# EAGLE design Proc (EAGLE 4.16)
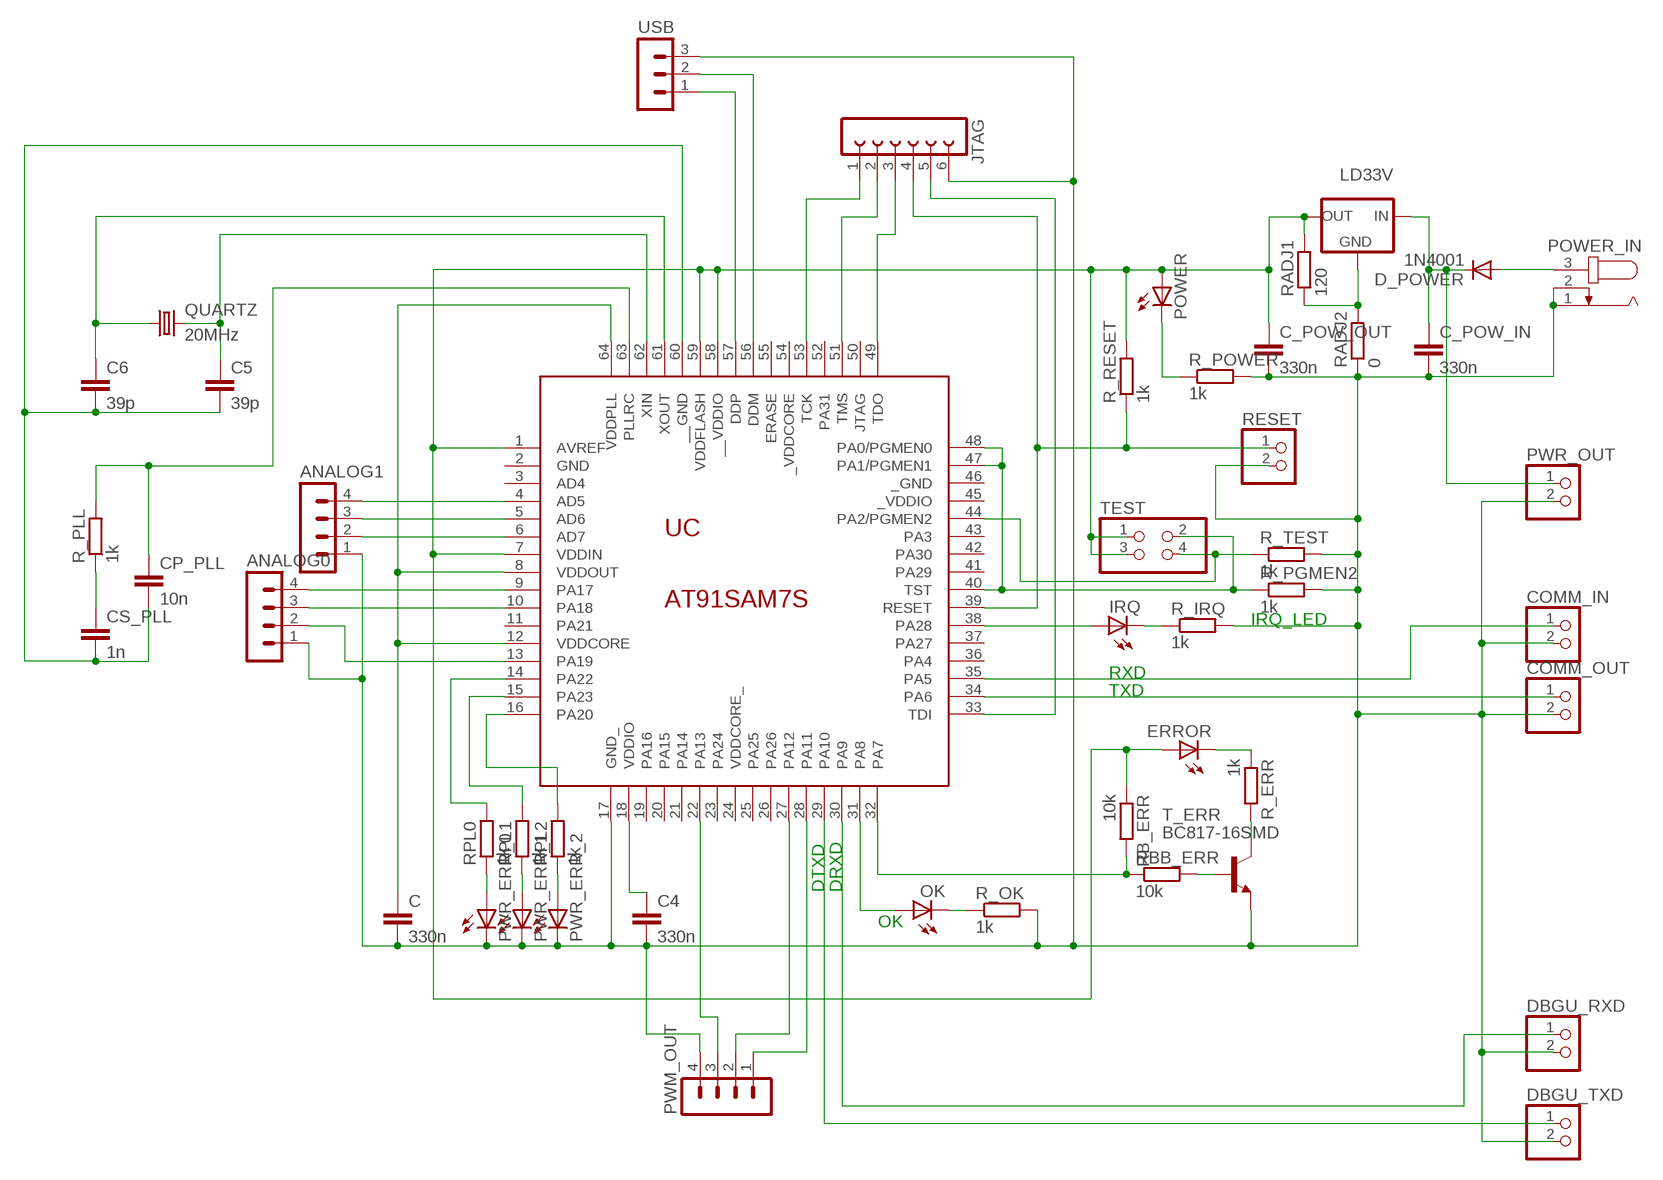
[diagram p0: schematic, sheet 1]

## Parts
ANALOG0  MA04-1  [MA04-1]
ANALOG1  MA04-1  [MA04-1]
C  330n  C-EUC1210  [C1210]
C4  330n  C-EUC1210  [C1210]
C5  39p  C-EUC1210  [C1210]
C6  39p  C-EUC1210  [C1210]
C_POW_IN  330n  C-EUC1210  [C1210]
C_POW_OUT  330n  C-EUC1210  [C1210]
COMM_IN  PINHD-1X2  [1X02]
COMM_OUT  PINHD-1X2  [1X02]
CP_PLL  10n  C-EUC1210  [C1210]
CS_PLL  1n  C-EUC1210  [C1210]
D_POWER  1N4001  DIODE-SMB  [SMB]
DBGU_RXD  PINHD-1X2  [1X02]
DBGU_TXD  PINHD-1X2  [1X02]
ERROR  LEDCHIPLED_1206  [CHIPLED_1206]
IRQ  LEDCHIPLED_1206  [CHIPLED_1206]
JTAG  FE06-1  [FE06]
LD33V  LD33  [LD33]
OK  LEDCHIPLED_1206  [CHIPLED_1206]
POWER  LEDCHIPLED_1206  [CHIPLED_1206]
POWER_IN  JACK-PLUG0  [SPC4077]
PWM_OUT  MA04-1  [MA04-1]
PWR_ERR_0  LEDCHIPLED_1206  [CHIPLED_1206]
PWR_ERR_1  LEDCHIPLED_1206  [CHIPLED_1206]
PWR_ERR_2  LEDCHIPLED_1206  [CHIPLED_1206]
PWR_OUT  PINHD-1X2  [1X02]
QUARTZ  20MHz  CRYSTALSM49  [SM49]
R_ERR  1k  R-EU_M1206  [M1206]
R_IRQ  1k  R-EU_M1206  [M1206]
R_OK  1k  R-EU_M1206  [M1206]
R_PGMEN2  1k  R-EU_M1206  [M1206]
R_PLL  1k  R-EU_M1206  [M1206]
R_POWER  1k  R-EU_M1206  [M1206]
R_RESET  1k  R-EU_M1206  [M1206]
R_TEST  1k  R-EU_M1206  [M1206]
RADJ1  120  R-EU_M1206  [M1206]
RADJ2  0  R-EU_M1206  [M1206]
RB_ERR  10k  R-EU_M1206  [M1206]
RBB_ERR  10k  R-EU_M1206  [M1206]
RESET  PINHD-1X2  [1X02]
RPL0  1k  R-EU_M1206  [M1206]
RPL1  1k  R-EU_M1206  [M1206]
RPL2  1k  R-EU_M1206  [M1206]
T_ERR  BC817-16SMD  [SOT23-BEC]
TEST  PINHD-2X2  [2X02]
UC  AT91SAM7S  [VQFP64]
USB  MA03-1  [MA03-1]

## Nets
N$1: ERROR.C R_ERR.1
N$2: C.1 UC.8(VDDOUT) UC.12(VDDCORE) UC.64(VDDPLL)
N$3: DBGU_RXD.1 UC.30(PA9)
N$4: C4.1 UC.18(VDDIO)
N$5: C5.2 C6.2 CP_PLL.2 CS_PLL.2 UC.60(__GND)
N$6: D_POWER.A POWER_IN.3
N$7: DBGU_TXD.1 UC.29(PA10)
N$8: POWER.C R_POWER.1
N$9: R_PGMEN2.1 TEST.2 UC.40(TST) UC.47(PA1/PGMEN1) UC.48(PA0/PGMEN0)
N$10: C6.1 QUARTZ.1 UC.61(XOUT)
N$11: C5.1 QUARTZ.2 UC.62(XIN)
N$12: R_TEST.1 TEST.4 UC.44(PA2/PGMEN2)
N$13: ANALOG1.4 UC.4(AD5)
N$14: CP_PLL.1 R_PLL.2 UC.63(PLLRC)
N$15: CS_PLL.1 R_PLL.1
N$16: RBB_ERR.2 T_ERR.B
N$17: JTAG.1 UC.53(TCK)
N$18: JTAG.2 UC.51(TMS)
N$19: JTAG.3 UC.49(TDO)
N$20: JTAG.5 UC.33(TDI)
N$21: JTAG.4 R_RESET.1 RESET.1 UC.39(RESET)
N$23: COMM_IN.1 UC.35(PA5)
N$24: LD33V.GND RADJ1.1 RADJ2.2
N$26: COMM_OUT.1 UC.34(PA6)
N$27: UC.57(DDP) USB.1
N$28: UC.56(DDM) USB.2
N$29: ANALOG0.1 ANALOG1.1 C4.2 C.2 C_POW_IN.2 C_POW_OUT.2 COMM_IN.2 COMM_OUT.2 DBGU_RXD.2 DBGU_TXD.2 JTAG.6 POWER_IN.1 POWER_IN.2 PWM_OUT.4 PWR_ERR_0.C PWR_ERR_1.C PWR_ERR_2.C PWR_OUT.2 R_IRQ.2 R_OK.2 R_PGMEN2.2 R_POWER.2 R_TEST.2 RADJ2.1 RESET.2 T_ERR.E UC.17(GND_) USB.3
N$30: PWM_OUT.1 UC.28(PA11)
N$31: PWM_OUT.2 UC.27(PA12)
N$32: PWM_OUT.3 UC.22(PA13)
N$33: ANALOG1.3 UC.5(AD6)
N$34: ANALOG1.2 UC.6(AD7)
N$35: ANALOG0.4 UC.9(PA17)
N$36: ANALOG0.3 UC.10(PA18)
N$37: ANALOG0.2 UC.13(PA19)
N$38: IRQ.A UC.38(PA28)
N$39: IRQ.C R_IRQ.1
N$40: RB_ERR.2 RBB_ERR.1 UC.32(PA7)
N$41: C_POW_OUT.1 ERROR.A LD33V.OUT POWER.A R_RESET.2 RADJ1.2 RB_ERR.1 TEST.1 TEST.3 UC.1(AVREF) UC.7(VDDIN) UC.58(__VDDIO) UC.59(VDDFLASH)
N$44: R_ERR.2 T_ERR.C
N$45: OK.A UC.31(PA8)
N$46: OK.C R_OK.1
N$47: RPL0.2 UC.14(PA22)
N$48: RPL1.2 UC.15(PA23)
N$49: RPL2.2 UC.16(PA20)
N$50: PWR_ERR_2.A RPL2.1
N$51: PWR_ERR_1.A RPL1.1
N$52: PWR_ERR_0.A RPL0.1
PWR___: C_POW_IN.1 D_POWER.C LD33V.IN PWR_OUT.1
Unconnected: UC.2(GND) UC.3(AD4) UC.11(PA21) UC.19(PA16) UC.20(PA15) UC.21(PA14) UC.23(PA24) UC.24(VDDCORE_) UC.25(PA25) UC.26(PA26) UC.36(PA4) UC.37(PA27) UC.41(PA29) UC.42(PA30) UC.43(PA3) UC.45(_VDDIO) UC.46(_GND) UC.50(JTAG) UC.52(PA31) UC.54(_VDDCORE) UC.55(ERASE)

## Notes on the sheet
- IRQ_LED
- RXD
- TXD
- DTXD | DRXD
- OK

## Library data of the parts
ANALOG0 ANALOG1 PWM_OUT = con-lstb:MA04-1: PIN HEADER
C C4-C6 C_POW_IN C_POW_OUT CP_PLL CS_PLL = rcl:C-EU: CAPACITOR, European symbol
COMM_IN COMM_OUT DBGU_RXD DBGU_TXD PWR_OUT RESET = pinhead:PINHD-1X2: PIN HEADER
D_POWER = diode:DIODE-: DIODE
ERROR IRQ OK POWER PWR_ERR_0 PWR_ERR_1 PWR_ERR_2 = led:LED: LED OSRAM: - CHIPLED LG R971, LG N971, LY N971, LG Q971, LY Q971, LO R971, LY R971 LH N974, LH R974 LS Q976, LO Q976, LY Q976 LO Q996 - Hyper CHIPLED LW Q18S LB Q993, LB Q99A, LB R99A - SideLED LS A670, LO A670, LY A670, LG A670, LP A670 LB A673, LV A673, LT A673, LW A673 LH A674 LY A675 LS A676, LA A676, LO A676, LY A676, LW A676 LS A679, LY A679, LG A679 - Hyper Micro SIDELED® LS Y876, LA Y876, LO Y876, LY Y876 LT Y87S - SmartLED LW L88C, LW L88S LB L89C, LB L89S, LG L890 LS L89K, LO L89K, LY L89K LS L896, LA L896, LO L896, LY L896 - TOPLED LS T670, LO T670, LY T670, LG T670, LP T670 LSG T670, LSP T670, LSY T670, LOP T670, LYG T670 LG T671, LOG T671, LSG T671 LB T673, LV T673, LT T673, LW T673 LH T674 LS T676, LA T676, LO T676, LY T676, LB T676, LH T676, LSB T676, LW T676 LB T67C, LV T67C, LT T67C, LS T67K, LO T67K, LY T67K, LW E67C LS E67B, LA E67B, LO E67B, LY E67B, LB E67C, LV E67C, LT E67C LW T67C LS T679, LY T679, LG T679 LS T770, LO T770, LY T770, LG T770, LP T770 LB T773, LV T773, LT T773, LW T773 LH T774 LS E675, LA E675, LY E675, LS T675 LS T776, LA T776, LO T776, LY T776, LB T776 LHGB T686 LT T68C, LB T68C - Hyper Mini TOPLED® LB M676 - Mini TOPLED Santana® LG M470 LS M47K, LO M47K, LY M47K Source: http://www.osram.convergy.de - LUMILED® LXK2-PW12-R00, LXK2-PW12-S00, LXK2-PW14-U00, LXK2-PW14-V00 LXK2-PM12-R00, LXK2-PM12-S00, LXK2-PM14-U00 LXK2-PE12-Q00, LXK2-PE12-R00, LXK2-PE12-S00, LXK2-PE14-T00, LXK2-PE14-U00 LXK2-PB12-K00, LXK2-PB12-L00, LXK2-PB12-M00, LXK2-PB14-N00, LXK2-PB14-P00, LXK2-PB14-Q00 LXK2-PR12-L00, LXK2-PR12-M00, LXK2-PR14-Q00, LXK2-PR14-R00 LXK2-PD12-Q00, LXK2-PD12-R00, LXK2-PD12-S00 LXK2-PH12-R00, LXK2-PH12-S00 LXK2-PL12-P00, LXK2-PL12-Q00, LXK2-PL12-R00 Source: www.luxeon.com
JTAG = con-lsta:FE06-1: FEMALE HEADER
LD33V = AT91SAM7S:LD33: VOLTAGE REGULATOR
POWER_IN = con-jack:JACK-PLUG: DC POWER JACK Power Jack, DC, Right Angle, Through Hole, Rated 5A at 16VDC, PC Terminals Distributor: Farnell (www.Farnell.de) Drawing: 84N1161.pdf / 84N1162.pdf Manufacturer: SPC Technology (www.spctechnology.com) Type: SPC4077 / SPC 4078
QUARTZ = crystal:CRYSTAL: CRYSTAL
R_ERR R_IRQ R_OK R_PGMEN2 R_PLL R_POWER R_RESET R_TEST RADJ1 RADJ2 RB_ERR RBB_ERR RPL0 RPL1 RPL2 = rcl:R-EU_: RESISTOR, European symbol
T_ERR = transistor-npn:BC817*: NPN Transistor
TEST = pinhead:PINHD-2X2: PIN HEADER
UC = AT91SAM7S:AT91SAM7S
USB = con-lstb:MA03-1: PIN HEADER

## Board
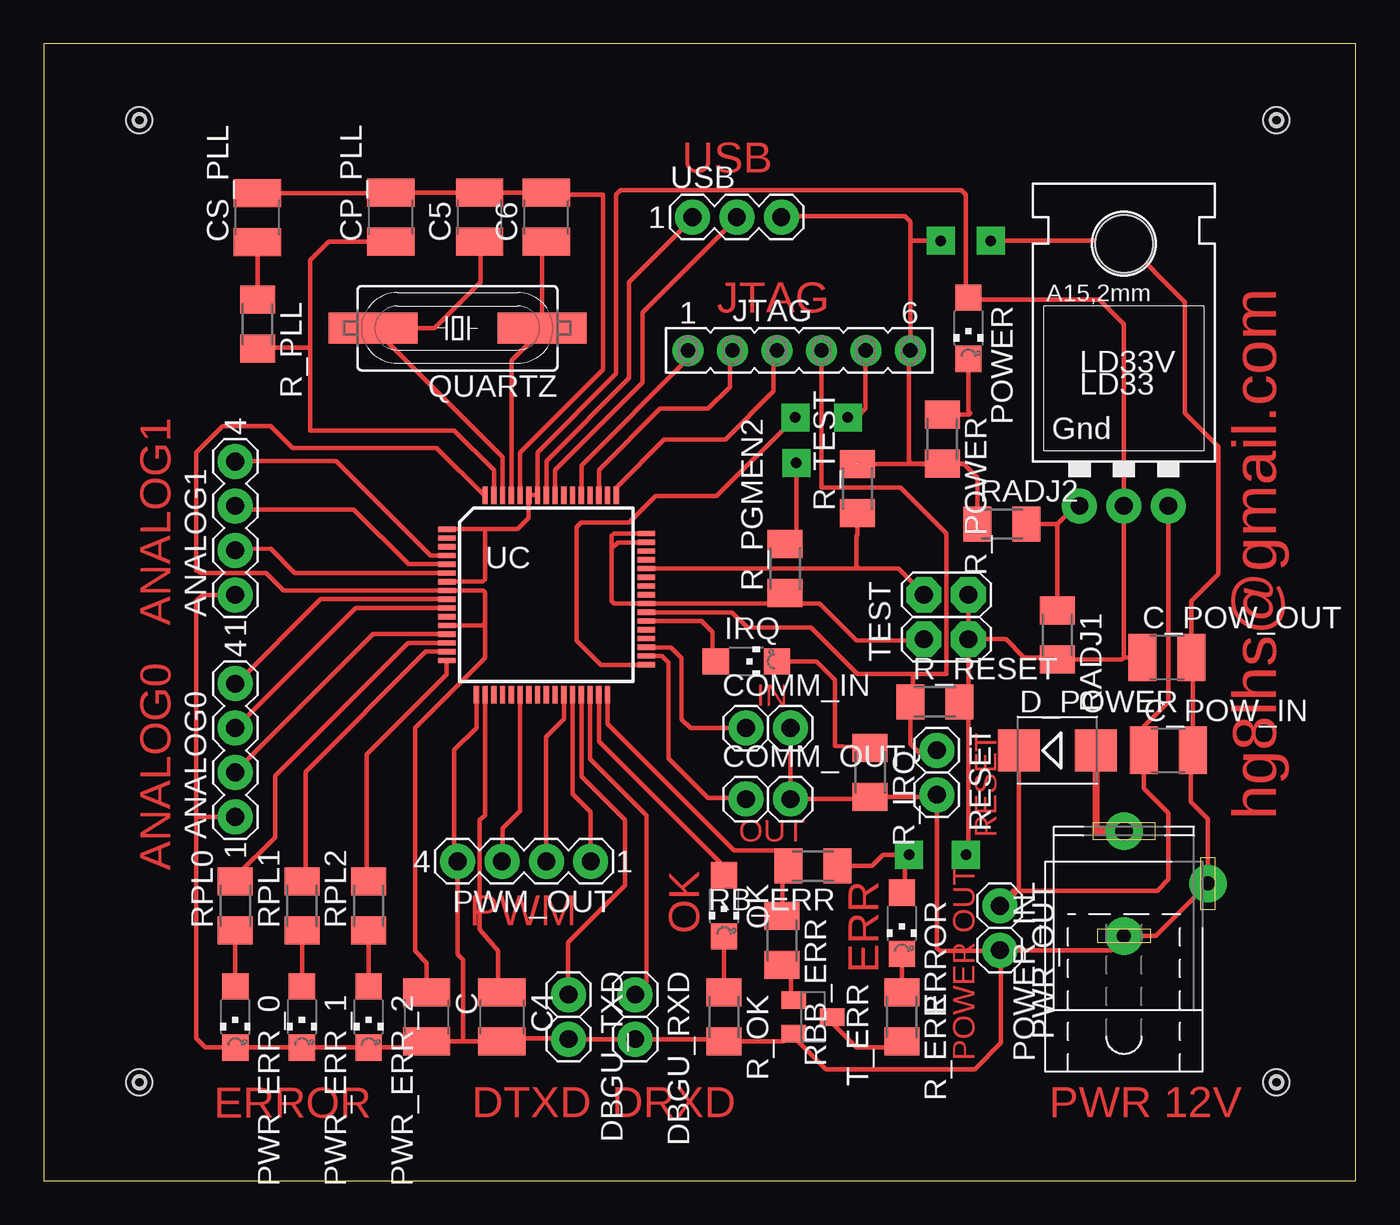
[diagram p1: board, top side]
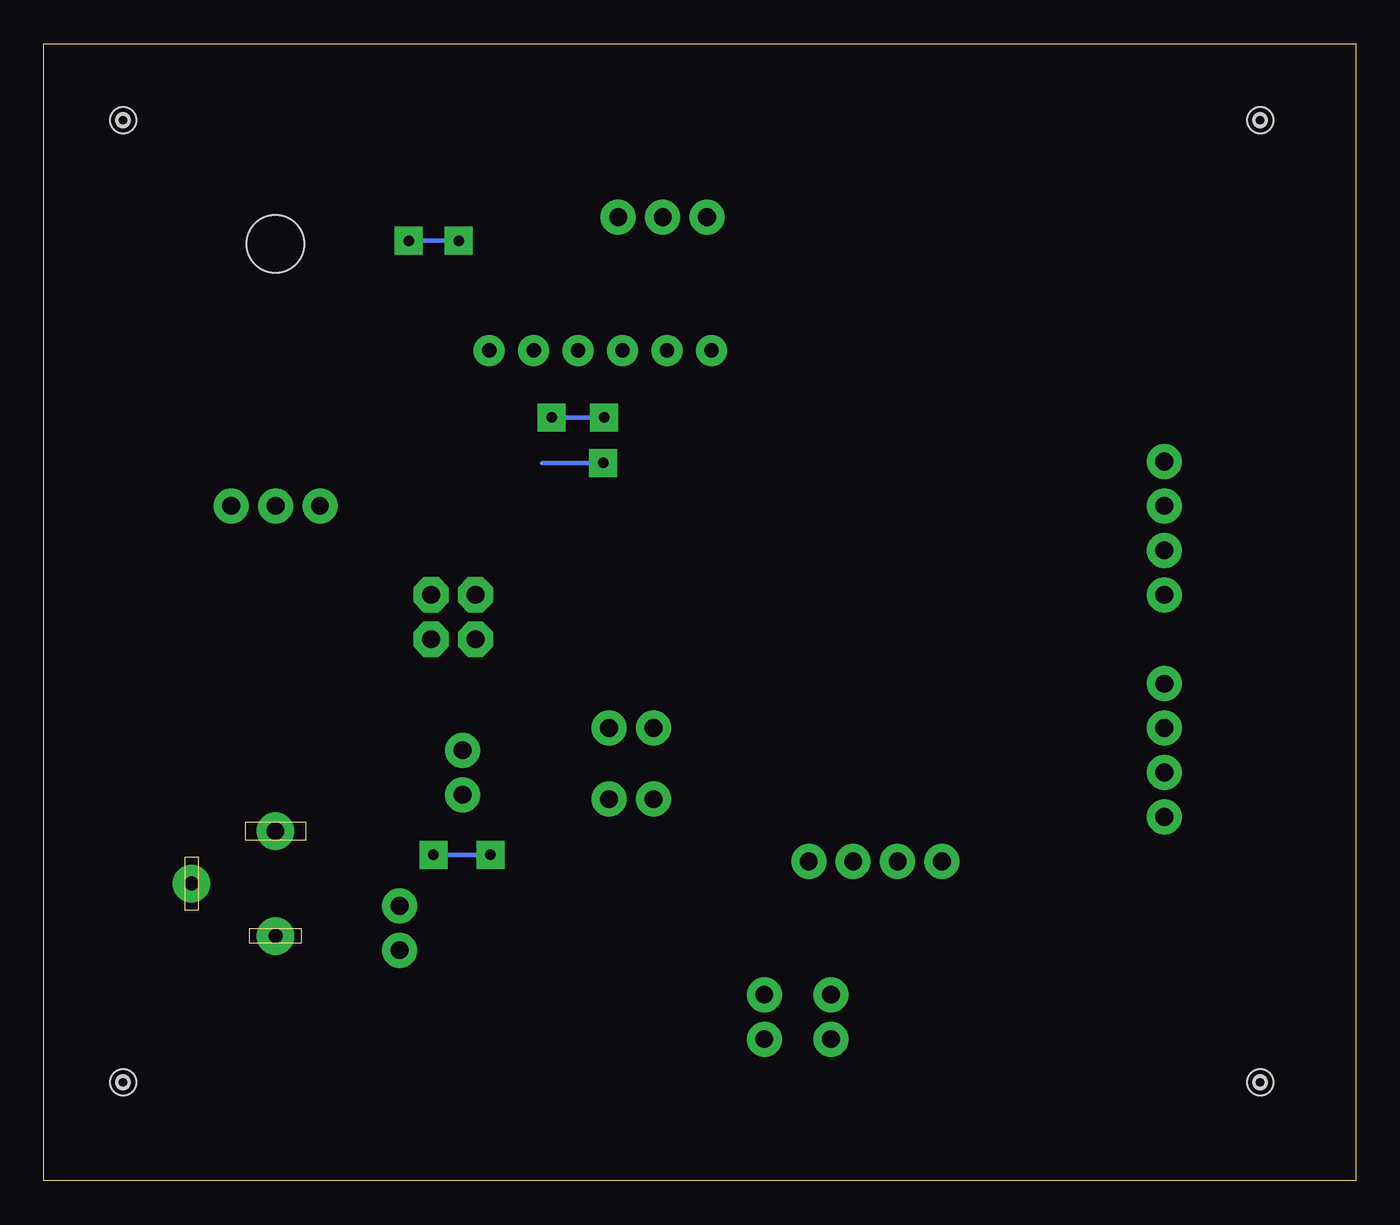
[diagram p2: board, bottom side, seen from below]

Size 75 x 65 mm. Coordinates in mm from the lower left corner, seen from the top.
Outline: 0,0 75,0 75,65 0,65 0,0
Copper layers (1*16): Top 0.0356mm / dielectric 1.5011mm / Bottom 0.0356mm
Design rules "default": minimum track width 0.1mm, minimum drill 1mil, track to track 0.2mm, track to pad 0.2mm, pad to pad 0.2mm, via to via 0.2mm, smd to smd 0mil, copper to edge 2.5mm, drill to drill 80mil, minimum pad ring 0.5mm, minimum via ring 0.5mm, stop-mask expansion 4mil, vias tented up to drill 0mil, thermal gap 10mil
Holes 0.6 mm at 5.47,60.63 5.47,5.63 70.47,5.63 70.47,60.63 5.47,5.63 70.47,5.63 70.47,60.63 5.47,60.63
Holes 1.5 mm at 5.47,60.63 70.47,60.63 70.47,5.63 5.47,5.63 5.47,60.63 70.47,60.63 70.47,5.63 5.47,5.63
Holes 0.7 mm at 5.47,60.63 70.47,60.63 70.47,5.63 5.47,5.63
Holes 0.8 mm at 5.47,60.63 70.47,60.63 70.47,5.63 5.47,5.63

### Footprints (pad centres in the part's own frame; a part is rotated, then mirrored left to right if it is on the bottom)
MA04-1 = drill 1.016 long: 1 -3.81,0; 2 -1.27,0; 3 1.27,0; 4 3.81,0
C1210 = smd 1.6 x 2.7: 1 -1.4,0; 2 1.4,0
1X02 = drill 1.016 long: 1 -1.27,0; 2 1.27,0
SMB = smd 2.4 x 2.4: A 2.2,0; C -2.2,0
CHIPLED_1206 = smd 1.5 x 1.5: A 0,-1.75; C 0,1.75
FE06 = drill 0.813 long: 1 -6.35,0; 2 -3.81,0; 3 -1.27,0; 4 1.27,0; 5 3.81,0; 6 6.35,0
LD33 = drill 1.016 long: GND -2.54,-3.81; IN 2.54,-3.81; OUT 0,-3.81 | hole 3.302: 0,11.176
SPC4077 = drill 0.8 pad 2.184 long: 1 -3,0; 2 0,-4.8 | drill 1 pad 2.184 long: 3 3,0
SM49 = smd 5.08 x 1.778: 1 -4.826,0; 2 4.826,0
M1206 = smd 1.6 x 2: 1 -1.4,0; 2 1.4,0
SOT23-BEC = smd 1 x 1.4: B -0.95,-1.1; C 0,1.1; E 0.95,-1.1
2X02 = drill 1.016 octagon: 1 -1.27,-1.27; 2 -1.27,1.27; 3 1.27,-1.27; 4 1.27,1.27
VQFP64 = smd 1 x 0.3: 1 -5.7,3.75; 2 -5.7,3.25; 3 -5.7,2.75; 4 -5.7,2.25; 5 -5.7,1.75; 6 -5.7,1.25; 7 -5.7,0.75; 8 -5.7,0.25; 9 -5.7,-0.25; 10 -5.7,-0.75; 11 -5.7,-1.25; 12 -5.7,-1.75; 13 -5.7,-2.25; 14 -5.7,-2.75; 15 -5.7,-3.25; 16 -5.7,-3.75; 33 5.7,-4; 34 5.7,-3.5; 35 5.7,-3; 36 5.7,-2.5; 37 5.7,-2; 38 5.7,-1.5; 39 5.7,-1; 40 5.7,-0.5; 41 5.7,0; 42 5.7,0.5; 43 5.7,1; 44 5.7,1.5; 45 5.7,2; 46 5.7,2.5; 47 5.7,3; 48 5.7,3.5 | smd 0.3 x 1: 17 -4,-5.7; 18 -3.5,-5.7; 19 -3,-5.7; 20 -2.5,-5.7; 21 -2,-5.7; 22 -1.5,-5.7; 23 -1,-5.7; 24 -0.5,-5.7; 25 0,-5.7; 26 0.5,-5.7; 27 1,-5.7; 28 1.5,-5.7; 29 2,-5.7; 30 2.5,-5.7; 31 3,-5.7; 32 3.5,-5.7; 49 4,5.7; 50 3.5,5.7; 51 3,5.7; 52 2.5,5.7; 53 2,5.7; 54 1.5,5.7; 55 1,5.7; 56 0.5,5.7; 57 0,5.7; 58 -0.5,5.7; 59 -1,5.7; 60 -1.5,5.7; 61 -2,5.7; 62 -2.5,5.7; 63 -3,5.7; 64 -3.5,5.7
MA03-1 = drill 1.016 long: 1 -2.54,0; 2 0,0; 3 2.54,0

### Placement (x,y rotation side)
ANALOG0  10.95,24.61 90 top
ANALOG1  10.95,37.31 90 top
C  21.88,9.37 270 top
C4  26.19,9.37 270 top
C5  24.92,55.09 90 top
C6  28.73,55.09 90 top
C_POW_IN  64.29,24.61 0 top
C_POW_OUT  64.2,29.92 0 top
COMM_IN  41.41,25.88 0 top
COMM_OUT  41.41,21.82 0 top
CP_PLL  19.84,55.09 90 top
CS_PLL  12.22,55.07 90 top
D_POWER  57.94,24.61 0 top
DBGU_RXD  33.81,9.37 270 top
DBGU_TXD  30,9.37 270 top
ERROR  49.05,14.72 180 top
IRQ  40.16,29.69 270 top
JTAG  43.18,47.47 0 top
LD33V  61.75,42.39 0 top
OK  38.89,15.72 180 top
POWER  52.86,48.74 180 top
POWER_IN  61.75,16.99 90 top
PWM_OUT  27.46,18.26 180 top
PWR_ERR_0  10.95,9.37 180 top
PWR_ERR_1  14.76,9.37 180 top
PWR_ERR_2  18.57,9.37 180 top
PWR_OUT  54.65,14.45 270 top
QUARTZ  23.65,48.74 180 top
R_ERR  49.05,9.37 270 top
R_IRQ  47.24,23.34 270 top
R_OK  38.89,9.37 270 top
R_PGMEN2  42.38,35 90 top
R_PLL  12.22,48.97 270 top
R_POWER  51.36,42.39 270 top
R_RESET  50.95,27.38 0 top
R_TEST  46.51,39.58 90 top
RADJ1  57.94,31.19 270 top
RADJ2  54.77,37.54 0 top
RB_ERR  43.97,17.99 180 top
RBB_ERR  42.2,13.73 270 top
RESET  51.05,23.34 270 top
RPL0  10.95,15.72 90 top
RPL1  14.76,15.72 90 top
RPL2  18.57,15.72 90 top
T_ERR  43.97,9.37 270 top
TEST  51.59,32.23 90 top
UC  28.73,33.5 0 top
USB  39.62,55.09 0 top

### Tracks (layer width: path | path; a pad name or v marks a point on that pad's centre or on a via)
N$1
  Top 0.254: R_ERR.1 49.05,10.8 48.97,10.88 49.05,10.96 ERROR.C
N$2
  Top 0.254: UC.12 25.09,31.75 25.22,31.88 | 25.22,31.88 25.22,33.63 25.1,33.75 | 25.1,33.75 UC.8 | C.1 21.88,12.47 21.22,13.13 21.22,25.88 25.22,29.88 25.22,31.88 | 25.1,33.75 13.73,33.75 12.72,34.76 8.97,34.76 8.72,34.88 8.72,41.63 10.22,43.13 12.97,43.13 14.22,41.88 22.47,41.88 25.22,39.13 25.23,39.14 UC.64
N$3
  Top 0.254: UC.30 31.23,24.12 34.47,20.88 34.47,11.38 33.73,10.64 | 33.73,10.64 33.72,10.63 | 33.73,10.64 DBGU_RXD.1
N$4
  Top 0.254: UC.18 25.23,20.89 24.91,20.63 24.91,14.38 25.97,13.13 25.97,11.13 26.22,10.88 26.19,10.85 C4.1
N$5
  Top 0.254: CS_PLL.2 19.63,56.47 19.72,56.38 CP_PLL.2 24.86,56.49 24.92,56.43 | 24.92,56.43 24.97,56.38 | 24.92,56.43 C5.2 28.61,56.49 28.72,56.38 | UC.60 27.23,41.64 31.97,46.38 31.97,56.38 28.72,56.38 | 28.72,56.38 28.73,56.39 C6.2
N$6
  Top 0.406: D_POWER.A 60.16,24.61 60.16,19.99 POWER_IN.3
N$7
  Top 0.254: UC.29 30.73,23.12 33.22,20.63 33.22,16.88 29.97,13.63 29.97,10.63 29.98,10.64 DBGU_TXD.1
N$8
  Top 0.254: R_POWER.1 52.88,43.79 52.97,43.88 52.86,43.99 POWER.C
N$9
  Top 0.254: TEST.2 50.3,30.96 50.22,30.88 46.47,30.88 44.35,33 42.38,33 UC.40 32.6,33 32.47,33.13 32.47,36.13 | UC.47 32.84,36.5 32.47,36.13 | UC.48 32.59,37 32.47,36.88 32.47,36.13
  Top 0.406: 42.38,33 R_PGMEN2.1
N$10
  Top 0.254: C6.1 28.73,53.39 28.48,53.14 QUARTZ.1 28.48,48.64 26.73,46.89 UC.61
N$11
  Top 0.254: C5.1 24.97,53.63 24.97,51.38 22.33,48.74 QUARTZ.2 18.86,48.74 26.23,41.37 UC.62
N$12
  Top 0.254: TEST.4 50.32,33.53 48.85,35 | UC.44 48.85,35 | 48.85,35 46.6,35 46.47,35.13 46.47,36.88 46.51,36.92 R_TEST.1
N$13
  Top 0.254: UC.4 22.1,35.75 16.72,41.13 10.97,41.13 ANALOG1.4
N$14
  Top 0.254: CP_PLL.1 16.28,53.69 15.22,52.63 15.22,47.63 | R_PLL.2 12.41,47.57 12.47,47.63 15.22,47.63 | UC.63 25.73,40.62 23.47,42.88 15.22,42.88 15.22,47.63
N$15
  Top 0.254: 12.22,50.13 R_PLL.1 CS_PLL.1
N$16
  Top 0.254: RBB_ERR.2 42.52,11.83 42.72,11.63 42.72,10.38 42.78,10.32 T_ERR.B
N$17
  Top 0.254: UC.53 30.73,40.89 36.72,46.88 36.72,47.38 36.81,47.47 JTAG.1
N$18
  Top 0.254: UC.51 31.73,40.64 35.22,44.13 37.97,44.13 39.22,45.38 39.22,47.13 39.47,47.38 JTAG.2
N$19
  Top 0.254: UC.49 32.73,39.64 35.47,42.38 38.97,42.38 41.72,45.13 41.72,47.13 41.97,47.38 41.91,47.44 JTAG.3
N$20  (via drill 0.6)
  Top 0.254: UC.33 31.85,29.5 30.47,30.88 30.47,37.38 30.72,37.63 33.47,37.63 34.97,39.13 38.47,39.13 v42.97,43.63 | v45.97,43.63 46.47,43.63 46.97,44.13 46.97,47.38 46.99,47.4 JTAG.5
  Bottom 0.254: v42.97,43.63 v45.97,43.63
N$21
  Top 0.254: UC.39 39.35,32.5 40.22,31.63 43.85,31.63 46.51,28.97 49.69,28.97 | 50.97,24.63 50.99,24.61 RESET.1 50.95,24.52 50,24.52 49.55,24.97 R_RESET.1 49.69,27.38 49.69,28.97 | JTAG.4 44.45,39.65 44.47,39.63 48.97,39.63 51.59,37.01 51.59,28.96 | 51.59,28.96 51.59,28.97 49.69,28.97 | 51.59,28.96
N$23
  Top 0.254: UC.35 35.85,30.5 36.47,29.88 36.47,26.38 36.97,25.88 COMM_IN.1
N$24
  Top 0.254: LD33V.GND 59.21,38.81 57.94,37.54 | 57.94,37.54 RADJ2.2 | RADJ1.1 57.94,37.54
N$26
  Top 0.254: COMM_OUT.1 40.03,21.82 39.72,21.88 37.97,21.88 35.72,24.13 35.72,29.63 35.35,30 UC.34
N$27
  Top 0.254: UC.57 28.73,41.14 33.47,45.88 33.47,51.38 37.08,54.99 USB.1
N$28
  Top 0.254: UC.56 29.23,40.64 34.22,45.63 34.22,49.63 39.68,55.09 | 39.68,55.09 39.72,55.13 | 39.68,55.09 USB.2
N$29  (via drill 0.6)  (1 unrouted)
  Top 0.254: ANALOG1.1 9.09,33.5 8.72,33.13 8.72,20.88 | 8.72,20.88 8.72,8.13 9.22,7.63 10.97,7.63 PWR_ERR_0.C PWR_ERR_1.C | ANALOG0.1 8.8,20.8 8.72,20.88 | PWR_ERR_1.C 14.96,7.62 14.97,7.63 | PWR_ERR_1.C PWR_ERR_2.C | PWR_ERR_2.C 18.71,7.62 18.72,7.63 | PWR_ERR_2.C 22.21,7.62 22.47,7.88 C.2 23.97,7.97 | 26.19,8.1 26.22,8.13 29.97,8.13 DBGU_TXD.2 DBGU_RXD.2 | 26.19,8.1 C4.2 | 23.97,7.97 26.06,7.97 26.19,8.1 | 23.97,7.97 23.97,12.63 23.65,12.95 PWM_OUT.4 23.59,18.26 23.47,18.38 23.47,24.63 24.73,25.89 UC.17 | DBGU_RXD.2 33.94,8.1 33.97,8.13 | DBGU_RXD.2 38.69,8.1 38.72,8.13 R_OK.2 42.31,7.97 42.72,8.38 | T_ERR.E 42.76,8.42 42.72,8.38 | 42.72,8.38 44.72,6.38 53.22,6.38 54.72,7.88 54.72,13.13 | 49.53,53.73 JTAG.6 49.53,47.44 49.47,47.38 49.47,41.13 49.61,40.99 R_POWER.2 52.58,40.99 52.86,40.72 | 49.53,53.73 49.53,54.82 49.22,55.13 42.22,55.13 42.18,55.09 USB.3 | COMM_IN.2 42.68,21.92 42.72,21.88 42.68,21.84 COMM_OUT.2 47.16,21.82 47.24,21.9 R_IRQ.2 50.91,21.94 50.97,21.88 51.05,21.96 RESET.2 51.05,13.3 51.22,13.13 54.72,13.13 | 54.72,13.13 55.42,13.18 PWR_OUT.2 61.02,13.18 61.75,13.91 POWER_IN.1 63.58,13.99 66.55,16.96 POWER_IN.2 66.55,20.68 65.56,21.66 65.56,24.84 65.69,24.71 C_POW_IN.2 65.69,29.79 65.56,29.92 C_POW_OUT.2 65.6,33.14 67.15,34.68 67.15,41.98 65.24,43.89 65.24,50.24 61.75,53.73 v54.13,53.73 | RADJ2.1 53.36,40.21 52.86,40.72 | R_TEST.2 52.59,40.98 52.86,40.72 | v51.27,53.73 49.53,53.73 | R_PGMEN2.2 43.02,36.4 v43.02,41.03
  Bottom 0.254: v54.13,53.73 v51.27,53.73 | v43.02,41.03 46.51,41.03
N$30
  Top 0.254: PWM_OUT.1 31.27,21.08 30.23,22.12 UC.28
N$31
  Top 0.254: UC.27 29.73,26.39 28.72,25.38 28.72,18.38 28.73,18.37 PWM_OUT.2
N$32
  Top 0.254: UC.22 27.23,21.14 26.22,20.13 26.22,18.38 26.19,18.35 PWM_OUT.3
N$33
  Top 0.254: UC.5 20.85,35.25 17.72,38.38 11.22,38.38 10.97,38.63 10.95,38.61 ANALOG1.3
N$34
  Top 0.254: ANALOG1.2 10.95,36.11 12.97,36.13 14.35,34.75 UC.6
N$35
  Top 0.254: ANALOG0.4 10.95,28.4 10.97,28.38 15.84,33.25 UC.9
N$36
  Top 0.254: ANALOG0.3 10.97,25.88 17.84,32.75 UC.10
N$37
  Top 0.254: ANALOG0.2 10.95,23.36 18.84,31.25 UC.13
N$38
  Top 0.254: UC.38 37.6,32 38.22,31.38 38.22,30.13 38.47,29.88 38.41,29.82 IRQ.A
N$39
  Top 0.254: IRQ.C 44.16,29.69 45.22,28.63 45.22,24.88 45.24,24.86 R_IRQ.1
N$40
  Top 0.254: RB_ERR.2 42.08,17.74 42.22,17.63 | RBB_ERR.1 42.22,14.63 42.22,17.63 | UC.32 32.23,26.12 39.47,18.88 42.22,18.88 42.22,17.63
N$41  (via drill 0.6)
  Top 0.254: 25.22,37.25 UC.1 | 25.22,37.25 27.09,37.25 27.72,37.88 27.72,39.13 27.73,39.14 UC.59 28.15,39.2 28.22,39.13 28.23,39.14 | 28.23,39.14 UC.58 | UC.7 25.09,34.25 25.22,34.38 25.22,37.25 | 28.23,39.14 28.23,41.64 32.72,46.13 32.72,56.38 32.97,56.63 52.47,56.63 52.72,56.38 52.72,50.63 POWER.A 52.97,50.38 60.34,50.38 61.75,48.97 LD33V.OUT 61.75,29.92 | TEST.1 52.86,27.38 | 52.86,27.38 52.86,19.02 v52.72,18.63 | ERROR.A 49.05,16.55 48.97,16.63 49.22,16.88 49.22,18.38 v49.47,18.63 47.97,18.63 47.33,17.99 RB_ERR.1 | 61.75,29.92 C_POW_OUT.1 | 52.86,33.73 TEST.3 TEST.1 | TEST.1 55,30.96 56.03,29.92 57.94,29.92 RADJ1.2 61.62,29.79 61.75,29.92 | 52.86,27.38 R_RESET.2
  Bottom 0.254: v52.72,18.63 v49.47,18.63
N$44
  Top 0.254: T_ERR.C 45.07,9.03 46.47,7.63 48.47,7.63 48.97,8.13 49.05,8.05 R_ERR.2
N$45
  Top 0.254: UC.31 31.73,25.12 38.72,18.13 38.72,17.88 38.97,17.63 38.89,17.55 OK.A
N$46
  Top 0.254: R_OK.1 38.89,10.8 38.97,10.88 38.89,10.96 OK.C
N$47
  Top 0.254: UC.14 20.84,30.75 13.22,23.13 13.22,19.63 10.95,17.36 RPL0.2
N$48
  Top 0.254: UC.15 21.84,30.25 14.97,23.38 14.97,17.63 14.72,17.38 14.76,17.34 RPL1.2
N$49
  Top 0.254: UC.16 23.03,28.94 18.47,24.38 18.47,17.13 18.48,17.12 RPL2.2
N$50
  Top 0.254: PWR_ERR_2.A 18.48,11.12 18.47,11.13 18.57,11.23 RPL2.1
N$51
  Top 0.254: PWR_ERR_1.A 14.73,11.12 14.72,11.13 14.76,11.17 RPL1.1
N$52
  Top 0.254: PWR_ERR_0.A 10.95,11.36 10.97,11.38 10.95,11.4 RPL0.1
PWR___
  Top 0.254: PWR_OUT.1 54.65,15.7 54.72,15.63 55.54,16.45 | D_POWER.C 55.74,16.65 55.54,16.45 | 55.54,16.45 55.4,16.58 63.66,16.58 64.29,17.22 64.29,21.03 62.89,22.43 C_POW_IN.1 62.89,25.98 64.29,27.38 LD33V.IN

### Text on the board
Top: USB | JTAG | ANALOG1 | ANALOG0 | IN | hg8lhs@gmail.com | OUT | RESET | PWM | OK | ERR | POWER OUT | ERROR | DTXD | DRXD | PWR 12V